# EasyEDA Pro project ProProject_AD9833.epro, schematic Schematic1
Create Date: 2023-10-06; Page Name: P1; Project Name: 双路AD9833; Schematic Name: Schematic1; Update Date: 2023-10-15; Company: 嘉立创EDA; Page Size: A5; Version: V1.0
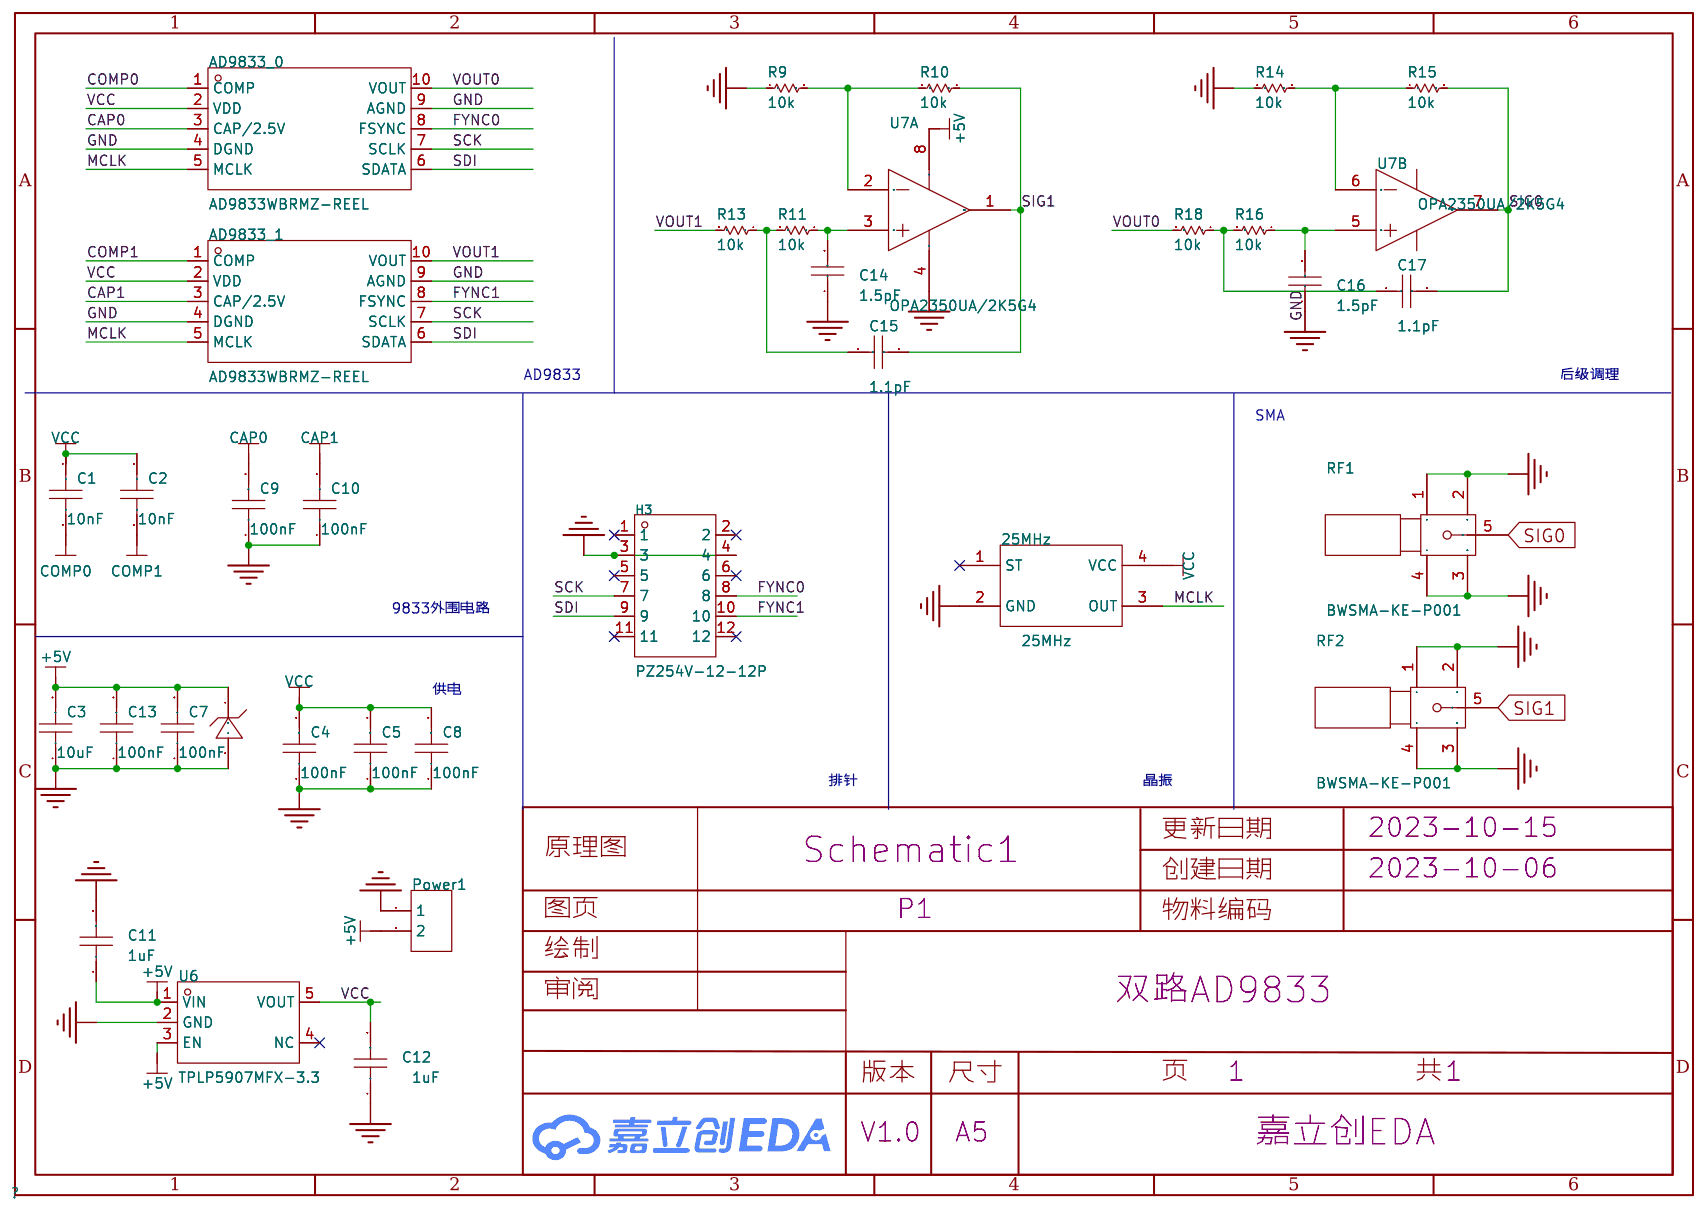
[diagram p0: schematic sheet]

## Parts
25MHz  25MHz  [OSC-SMD_4P-L3.2-W2.5-BL]
AD9833_0  AD9833WBRMZ-REEL  [MSOP-10_L3.0-W3.0-P0.50-LS5.0-BL]
AD9833_1  AD9833WBRMZ-REEL  [MSOP-10_L3.0-W3.0-P0.50-LS5.0-BL]
C1  10nF  [C0603]
C2  10nF  [C0603]
C3  10uF  [C0603]
C4  100nF  [C0603]
C5  100nF  [C0603]
C7  100nF  [C0603]
C8  100nF  [C0603]
C9  100nF  [C0603]
C10  100nF  [C0603]
C11  1uF  [C0603]
C12  1uF  [C0603]
C13  100nF  [C0603]
C14  1.5pF  [C0603]
C15  1.1pF  [C0603]
C16  1.5pF  [C0603]
C17  1.1pF  [C0603]
D4  SMBJ5.0A  [SMB_L4.4-W3.6-LS5.3-RD]
H3  PZ254V-12-12P  [HDR-TH_12P-P2.54-V-M-R2-C6-S2.54]
Power1  -  [KF2510_2P]
R9  10k  [R0603]
R10  10k  [R0603]
R11  10k  [R0603]
R13  10k  [R0603]
R14  10k  [R0603]
R15  10k  [R0603]
R16  10k  [R0603]
R18  10k  [R0603]
RF1  BWSMA-KE-P001  [SMA-SMD_BWSMA-KE-P001]  (no BOM)
RF2  BWSMA-KE-P001  [SMA-SMD_BWSMA-KE-P001]  (no BOM)
U6  TPLP5907MFX-3.3  [SOT-23-5_L2.9-W1.6-P0.95-LS2.8-BR]
U7  OPA2350UA/2K5G4  [SOIC-8_L5.0-W4.0-P1.27-LS6.1-BL]  (sections 1,2)

## Library data of the parts
25MHz = Q33310F70045400: 频率:11.2896MHz;工作电压:3.3V;; LCSC Part Name: 11.2896MHz 3.3V; Supplier Part: C32527; Manufacturer: EPSON(爱普生); Supplier Footprint: SMD3225-4P; JLCPCB Part Class: Extended Part; Datasheet: https://atta.szlcsc.com/upload/public/pdf/source/20161110/1478747426684.pdf; Supplier: LCSC; Supply Voltage: 3.3V; Supply Current (Max): 2.5mA; Operating Temperature: -40℃~+85℃
AD9833_0 AD9833_1 = AD9833WBRMZ-REEL: Supplier Part: C653880; Manufacturer: ADI(亚德诺)/LINEAR; Supplier Footprint: MSOP-10; JLCPCB Part Class: Extended Part; Datasheet: https://atta.szlcsc.com/upload/public/pdf/source/20200901/C653879_C7354661FE492369EE1E91E5EF14B86B.pdf; Supplier: LCSC
C1-C5 C7-C13 = CAP_0402: Supplier Footprint: 0402
C14-C17 = Cap0603
D4 = SMBJ5.0A_C726811: 极性:单向;; LCSC Part Name: 单向; Supplier Part: C726811; Manufacturer: TWGMC(台湾迪嘉); Supplier Footprint: SMB; JLCPCB Part Class: 扩展库; Datasheet: https://atta.szlcsc.com/upload/public/pdf/source/20200901/C726811_07201DC3516E92FF13903A0BAE18F725.pdf; Supplier: LCSC; Polarity: 单向
H3 = PZ254V-12-12P: 排数:双排;总PIN位数:12P;间距:2.54mm;插针结构:2x6P;行距:2.54mm;安装类型:直插;圆针/方针:方针;额定电流:-;额定电压:-;配合针长度:6mm;塑高:2.5mm;端接针长度:3mm;触头材质:黄铜;触头镀层:-;工作温度范围:-40℃~+105℃;颜色:黑色;; LCSC Part Name: 2.54mm 2x6P 直插 方针; Supplier Part: C492423; Manufacturer: XFCN(兴飞); Supplier Footprint: 插件,P=2.54mm; JLCPCB Part Class: Extended Part; Datasheet: https://atta.szlcsc.com/upload/public/pdf/source/20200309/C492423_E4E2C9BC0EB9D59A2ABE4377D2E234B2.pdf; Supplier: LCSC; Number of Rows: 双排; Number of Pins: 12P; Pitch: 2.54mm; Pin Structure: 2x6P; Row Spacing: 2.54mm; Mounting Type: 直插; Circluar Pins/Square Pins: 方针; Length of Mating Pin: 6mm; Insulation Height: 2.5mm; Length of End Connection Pin: 3mm; Contact Material: 黄铜; Operating Temperature Range: -40℃~+105℃; Color: 黑色
Power1 = KF2510_2P
R9-R11 R13-R16 R18 = Res0603
RF1 RF2 = BWSMA-KE-P001: 连接器类型:板端;射频系列:SMA;接口类型:内孔;端口数量:1;阻抗:-;频率-最大值:-;样式:偏脚;接口直径:5.2mm;接口长度/高度:-;工作温度范围:-;; LCSC Part Name: SMA 内孔 偏脚 SMA偏脚板端座子; Supplier Part: C496550; Manufacturer: BAT WIRELESS(蝙蝠无线); Supplier Footprint: 插件; JLCPCB Part Class: Extended Part; Datasheet: https://atta.szlcsc.com/upload/public/pdf/source/20200416/C496550_06668BF2E3B968EA39F96D17E7156373.pdf; Supplier: LCSC; Connector Type: 板端; RF Series: SMA; Interface Type: 内孔; Number of Ports: 1; Style: 偏脚; Interface Diameter: 5.2mm
U6 = TPLP5907MFX-3.3: LCSC Part Name: LP5907MFX-3.3; Supplier Part: C5370990; Manufacturer: TECH PUBLIC(台舟); Supplier Footprint: SOT-23-5; JLCPCB Part Class: Extended Part; Datasheet: https://atta.szlcsc.com/upload/public/pdf/source/20230314/FF2AD341DEE6F9B9360628D995F4E690.pdf; Supplier: LCSC
U7 = OPA2350UA/2K5G4: 双路单电源、轨到轨、高速、低噪声运算放大器 8-SOIC -40 to 85; Supplier Part: C2059575; Manufacturer: TI(德州仪器); Supplier Footprint: SOIC-8; JLCPCB Part Class: 扩展库; Supplier: LCSC

## Nets
+5V: C3.2 C7.2 C11.1 C13.2 D4.1(C) Power1.2 U6.1(VIN) U6.3(EN) U7.8(V+)
GND: 25MHz.2(GND) AD9833_0.4(DGND) AD9833_0.9(AGND) AD9833_1.4(DGND) AD9833_1.9(AGND) C3.1 C4.1 C5.1 C7.1 C8.1 C9.1 C10.1 C11.2 C12.1 C13.1 C14.1 C16.1 D4.2(A) H3.3 H3.4 Power1.1 R9.1 R14.1 RF1.1 RF1.2 RF1.3 RF1.4 RF2.1 RF2.2 RF2.3 RF2.4 U6.2(GND) U7.4(V-)
VCC: 25MHz.4(VCC) AD9833_0.2(VDD) AD9833_1.2(VDD) C1.1 C2.1 C4.2 C5.2 C8.2 C12.2 U6.5(VOUT)
CAP0: AD9833_0.3(CAP/2.5V) C9.2
CAP1: AD9833_1.3(CAP/2.5V) C10.2
COMP0: AD9833_0.1(COMP) C1.2
COMP1: AD9833_1.1(COMP) C2.2
FYNC0: AD9833_0.8(FSYNC) H3.8
FYNC1: AD9833_1.8(FSYNC) H3.10
MCLK: 25MHz.3(OUT) AD9833_0.5(MCLK) AD9833_1.5(MCLK)
SCK: AD9833_0.7(SCLK) AD9833_1.7(SCLK) H3.7
SDI: AD9833_0.6(SDATA) AD9833_1.6(SDATA) H3.9
SIG0: C17.2 R15.2 RF1.5 U7.7(OUTB)
SIG1: C15.2 R10.2 RF2.5 U7.1(OUTA)
VOUT0: AD9833_0.10(VOUT) R18.2
VOUT1: AD9833_1.10(VOUT) R13.2
$1N2894: R9.2 R10.1 U7.2(INA-)
$1N3186: R14.2 R15.1 U7.6(INB-)
$1N4984: C14.2 R11.1 U7.3(INA+)
$1N4997: C15.1 R11.2 R13.1
$1N5066: C16.2 R16.1 U7.5(INB+)
$1N5107: C17.1 R16.2 R18.1

Not connected (* = marked no-connect by the designer): 25MHz 1(ST)*; H3 1* 2* 5* 6* 11* 12*; U6 4(NC)*

## Notes on the sheet
- AD9833
- 后级调理
- SMA
- 9833外围电路
- 供电
- 排针
- 晶振
